# Altium schematic sheet Main.SchDoc
size A3; SheetNumber: 1; SheetTotal: 1
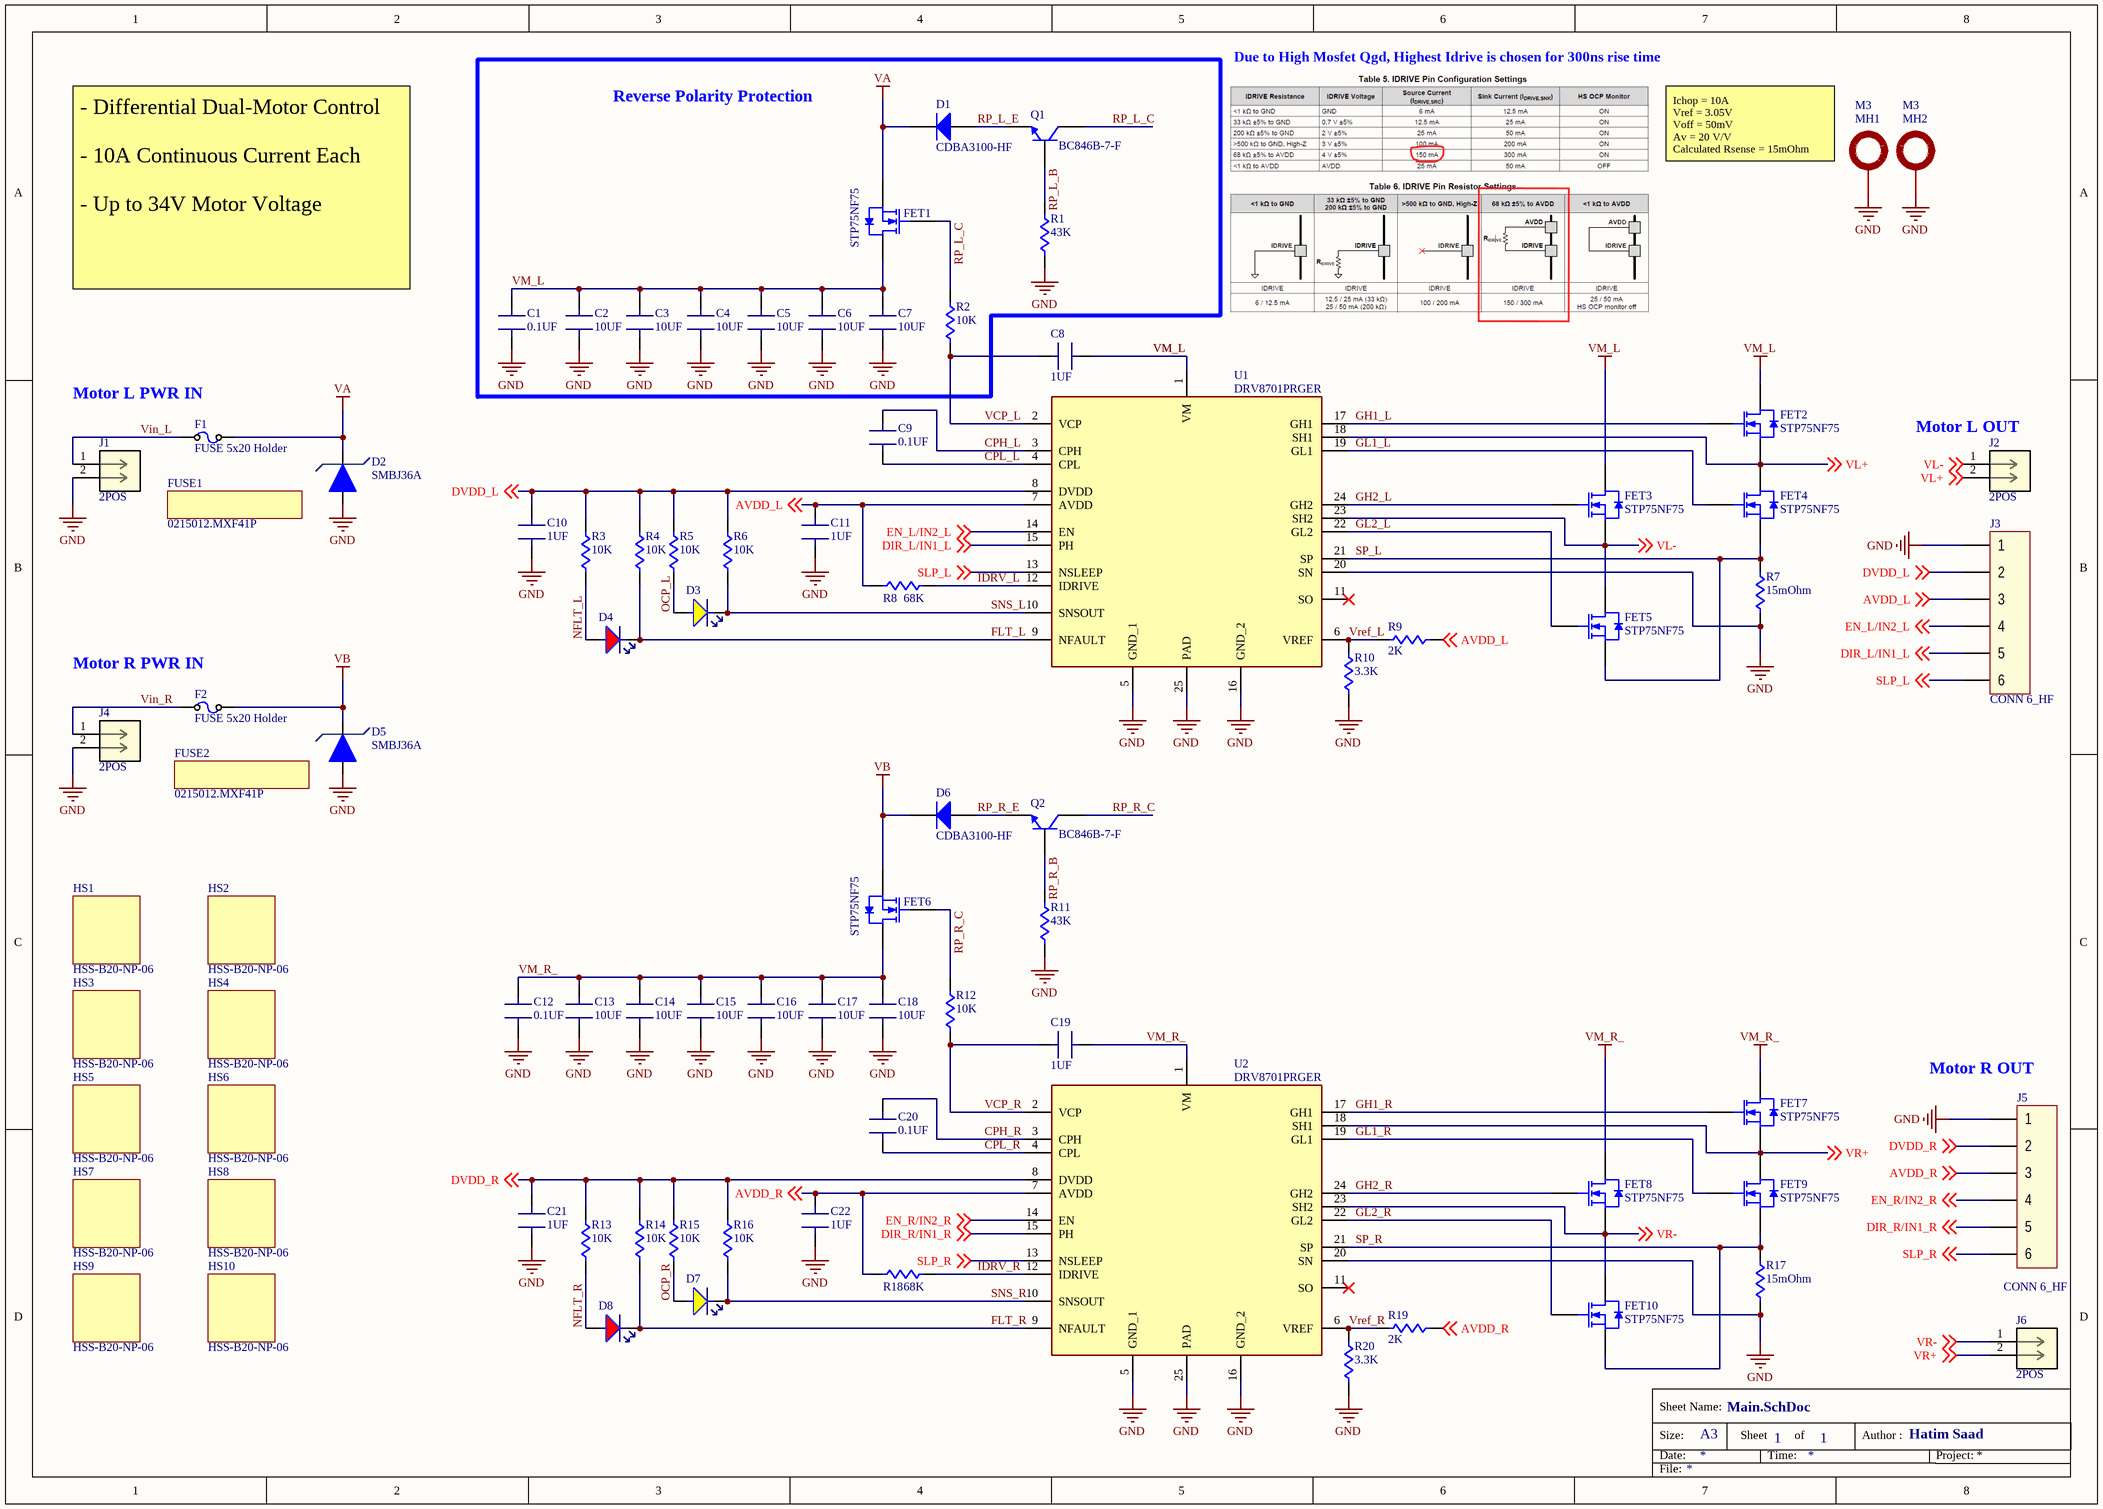
[diagram p0: Main.SchDoc]

## Parts
C1  0.1UF  [CAP: 0805]
C2  10UF  [CAP: 1210]
C3  10UF  [CAP: 1210]
C4  10UF  [CAP: 1210]
C5  10UF  [CAP: 1210]
C6  10UF  [CAP: 1210]
C7  10UF  [CAP: 1210]
C8  1UF  [CAP: 0805]
C9  0.1UF  [CAP: 0603]
C10  1UF  [CAP: 0603]
C11  1UF  [CAP: 0603]
C12  0.1UF  [CAP: 0805]
C13  10UF  [CAP: 1210]
C14  10UF  [CAP: 1210]
C15  10UF  [CAP: 1210]
C16  10UF  [CAP: 1210]
C17  10UF  [CAP: 1210]
C18  10UF  [CAP: 1210]
C19  1UF  [CAP: 0805]
C20  0.1UF  [CAP: 0603]
C21  1UF  [CAP: 0603]
C22  1UF  [CAP: 0603]
D1  CDBA3100-HF  [DIODE SMA]
D2  SMBJ36A  [DO-214AA]
D3  YELLOW  [LED: 0603Y]  (value not drawn)
D4  RED  [LED: 0603R]  (value not drawn)
D5  SMBJ36A  [DO-214AA]
D6  CDBA3100-HF  [DIODE SMA]
D7  YELLOW  [LED: 0603Y]  (value not drawn)
D8  RED  [LED: 0603R]  (value not drawn)
F1  FUSE 5x20 Holder  [FUSE: 5x20 Holder]
F2  FUSE 5x20 Holder  [FUSE: 5x20 Holder]
FET1  STP75NF75  [TO220-3]
FET2  STP75NF75  [TO220-3]
FET3  STP75NF75  [TO220-3]
FET4  STP75NF75  [TO220-3]
FET5  STP75NF75  [TO220-3]
FET6  STP75NF75  [TO220-3]
FET7  STP75NF75  [TO220-3]
FET8  STP75NF75  [TO220-3]
FET9  STP75NF75  [TO220-3]
FET10  STP75NF75  [TO220-3]
FUSE1  0215012.MXF41P  (mechanical)
FUSE2  0215012.MXF41P  (mechanical)
HS1  HSS-B20-NP-06  [HSS-B20-NP-06]
HS2  HSS-B20-NP-06  [HSS-B20-NP-06]
HS3  HSS-B20-NP-06  [HSS-B20-NP-06]
HS4  HSS-B20-NP-06  [HSS-B20-NP-06]
HS5  HSS-B20-NP-06  [HSS-B20-NP-06]
HS6  HSS-B20-NP-06  [HSS-B20-NP-06]
HS7  HSS-B20-NP-06  [HSS-B20-NP-06]
HS8  HSS-B20-NP-06  [HSS-B20-NP-06]
HS9  HSS-B20-NP-06  [HSS-B20-NP-06]
HS10  HSS-B20-NP-06  [HSS-B20-NP-06]
J1  2POS  [CONN2_710002_WRE - duplicate]
J2  2POS  [CONN2_710002_WRE - duplicate]
J3  CONN 6_HF  [CON: PLS-6]
J4  2POS  [CONN2_710002_WRE - duplicate]
J5  CONN 6_HF  [CON: PLS-6]
J6  2POS  [CONN2_710002_WRE - duplicate]
MH1  M3  [M3 Mounting Hole]  (no BOM)
MH2  M3  [M3 Mounting Hole]  (no BOM)
Q1  BC846B-7-F  [SOT23_3]
Q2  BC846B-7-F  [SOT23_3]
R1  43K  [RES: 0603]
R2  10K  [RES: 0805]
R3  10K  [RES: 0603]
R4  10K  [RES: 0603]
R5  10K  [RES: 0603]
R6  10K  [RES: 0603]
R7  15mOhm  [RES: 2512]
R8  68K  [RES: 0603]
R9  2K  [RES: 0603]
R10  3.3K  [RES: 0603]
R11  43K  [RES: 0603]
R12  10K  [RES: 0805]
R13  10K  [RES: 0603]
R14  10K  [RES: 0603]
R15  10K  [RES: 0603]
R16  10K  [RES: 0603]
R17  15mOhm  [RES: 2512]
R18  68K  [RES: 0603]
R19  2K  [RES: 0603]
R20  3.3K  [RES: 0603]
U1  DRV8701PRGER  [VQFN-24]
U2  DRV8701PRGER  [VQFN-24]

## Blocks framed on the sheet
Reverse Polarity Protection: C1-C7 D1 FET1 Q1 R1 R2

## Nets
GND: C1.1(A) C2.1(A) C3.1(A) C4.1(A) C5.1(A) C6.1(A) C7.1(A) C10.1(A) C11.1(A) C12.1(A) C13.1(A) C14.1(A) C15.1(A) C16.1(A) C17.1(A) C18.1(A) C21.1(A) C22.1(A) D2.1 D5.1 J1.2 J3.1 J4.2 J5.1 MH1.1 MH2.1 R1.1 R7.1 R10.2 R11.1 R17.1 R20.2 U1.5(GND_1) U1.16(GND_2) U1.20(SN) U1.25(PAD) U2.5(GND_1) U2.16(GND_2) U2.20(SN) U2.25(PAD)
VA: D1.2(K) D2.2 F1.2 FET1.3(S)
VB: D5.2 D6.2(K) F2.2 FET6.3(S)
VM_L: C1.2(B) C2.2(B) C3.2(B) C4.2(B) C5.2(B) C6.2(B) C7.2(B) C8.2(B) FET1.2(D) FET2.2(D) FET3.2(D) U1.1(VM)
VM_R_: C12.2(B) C13.2(B) C14.2(B) C15.2(B) C16.2(B) C17.2(B) C18.2(B) C19.2(B) FET6.2(D) FET7.2(D) FET8.2(D) U2.1(VM)
AVDD_L: C11.2(B) J3.3 R8.2 R9.2 U1.7(AVDD) ; off-sheet AVDD_L
AVDD_R: C22.2(B) J5.3 R18.2 R19.2 U2.7(AVDD) ; off-sheet AVDD_R
CPH_L: C9.2(B) U1.3(CPH)
CPH_R: C20.2(B) U2.3(CPH)
CPL_L: C9.1(A) U1.4(CPL)
CPL_R: C20.1(A) U2.4(CPL)
DIR_L/IN1_L: J3.5 U1.15(PH) ; off-sheet DIR_L/IN1_L
DIR_R/IN1_R: J5.5 U2.15(PH) ; off-sheet DIR_R/IN1_R
DVDD_L: C10.2(B) J3.2 R3.2 R4.2 R5.2 R6.2 U1.8(DVDD) ; off-sheet DVDD_L
DVDD_R: C21.2(B) J5.2 R13.2 R14.2 R15.2 R16.2 U2.8(DVDD) ; off-sheet DVDD_R
EN_L/IN2_L: J3.4 U1.14(EN) ; off-sheet EN_L/IN2_L
EN_R/IN2_R: J5.4 U2.14(EN) ; off-sheet EN_R/IN2_R
FLT_L: D4.1(C) R4.1 U1.9(NFAULT)
FLT_R: D8.1(C) R14.1 U2.9(NFAULT)
GH1_L: FET2.1(G) U1.17(GH1)
GH1_R: FET7.1(G) U2.17(GH1)
GH2_L: FET3.1(G) U1.24(GH2)
GH2_R: FET8.1(G) U2.24(GH2)
GL1_L: FET4.1(G) U1.19(GL1)
GL1_R: FET9.1(G) U2.19(GL1)
GL2_L: FET5.1(G) U1.22(GL2)
GL2_R: FET10.1(G) U2.22(GL2)
IDRV_L: R8.1 U1.12(IDRIVE)
IDRV_R: R18.1 U2.12(IDRIVE)
NFLT_L: D4.2(A) R3.1
NFLT_R: D8.2(A) R13.1
OCP_L: D3.2(A) R5.1
OCP_R: D7.2(A) R15.1
RP_L_B: Q1.1(B) R1.2
RP_L_C: FET1.1(G) Q1.3(C) R2.2
RP_L_E: D1.1(A) Q1.2(E)
RP_R_B: Q2.1(B) R11.2
RP_R_C: FET6.1(G) Q2.3(C) R12.2
RP_R_E: D6.1(A) Q2.2(E)
SLP_L: J3.6 U1.13(NSLEEP) ; off-sheet SLP_L
SLP_R: J5.6 U2.13(NSLEEP) ; off-sheet SLP_R
SNS_L: D3.1(C) R6.1 U1.10(SNSOUT)
SNS_R: D7.1(C) R16.1 U2.10(SNSOUT)
SP_L: FET4.3(S) FET5.3(S) R7.2 U1.21(SP)
SP_R: FET9.3(S) FET10.3(S) R17.2 U2.21(SP)
VCP_L: C8.1(A) R2.1 U1.2(VCP)
VCP_R: C19.1(A) R12.1 U2.2(VCP)
Vin_L: F1.1 J1.1
Vin_R: F2.1 J4.1
VL+: FET2.3(S) FET4.2(D) J2.2 U1.18(SH1) ; off-sheet VL+
VL-: FET3.3(S) FET5.2(D) J2.1 U1.23(SH2) ; off-sheet VL-
VR+: FET7.3(S) FET9.2(D) J6.2 U2.18(SH1) ; off-sheet VR+
VR-: FET8.3(S) FET10.2(D) J6.1 U2.23(SH2) ; off-sheet VR-
Vref_L: R9.1 R10.1 U1.6(VREF)
Vref_R: R19.1 R20.1 U2.6(VREF)

Not connected (* = marked no-connect by the designer): U1 11(SO)*; U2 11(SO)*

## Notes on the sheet
- Due to High Mosfet Qgd, Highest Idrive is chosen for 300ns rise time
- (near MH1) Ichop = 10A
  Vref = 3.05V
  Voff = 50mV
  Av = 20 V/V
  Calculated Rsense = 15mOhm
- - Differential Dual-Motor Control
  - 10A Continuous Current Each
  - Up to 34V Motor Voltage
- (near F1) Motor L PWR IN
- (near J2) Motor L OUT
- (near F2) Motor R PWR IN
- (near J5) Motor R OUT
- Size:
- Date:
- Sheet Name:
- A3
- Sheet
- Time:
- of
- Author :
- Hatim Saad
- Project:
- File:

## Library data of the parts
C1 C8 C12 C19 = CAP 0805: CAP SMD 0805
C2-C7 C13-C18 = CAP 1210: CAP SMD 1210
C9-C11 C20-C22 = CAP 0603: CAP SMD 0603
D1 D6 = 641-1747-1-ND: Diode Schottky 100V 3A (DC) Surface Mount DO-214AC (SMA); Supplier 1: Mouser; Supplier Part Number 1: 750-CDBA3100-HF
D2 D5 = SMBJ36A: ESD Protection Diodes / TVS Diodes 36volts 5uA 10.3 Amps Uni-Dir; Supplier 1: Mouser; Supplier Part Number 1: 652-SMBJ36A
D3 D7 = LED YELLOW 0603: LED YELLOW CLEAR 0603 SMD
D4 D8 = LED RED 0603: LED RED CLEAR 0603 SMD
F1 F2 = FUSE 5x20 Holder: FUSE: 5x20 Holder
FET1-FET10 = STP75NF75: MOSFETs N-Ch 75 Volt 80 Amp; Supplier 1: Mouser; Supplier Part Number 1: 511-STP75NF75
FUSE1 FUSE2 = 0215012.MXF41P: Cartridge Fuses FUSE 250V 5x20 PT RAD TL PB-FREE 12A; Supplier 1: Mouser; Supplier Part Number 1: 576-0215012.MXF41P
HS1-HS10 = HSS-B20-NP-06: Heat Sinks 19 x 19 x 9.52mm TO-220 bolt on; Supplier 1: Mouser; Supplier Part Number 1: 490-HSS-B20-NP-06
J1 J2 J4 J6 = 691213710002: TERM BLK 2POS SIDE ENTRY 5MM PCB; Mfr_Name: Wurth Electronics; RefDes: RefDes; Type: Type; Supplier 1: Mouser; Supplier Part Number 1: 710-691213710002
MH1 MH2 = Mounting Hole M3: Mounting Hole M3 Screw
Q1 Q2 = BC846B-FDICT-ND: Bipolar (BJT) Transistor NPN 65V 100mA 300MHz 300mW Surface Mount SOT-23-3; Supplier 1: Mouser; Supplier Part Number 1: 621-BC846B-7-F
R1 R3-R6 R8-R11 R13-R16 R18-R20 = RES 0603: RES SMD 0603
R2 R12 = RES 0805: RES SMD 0805
R7 R17 = CSNL2512FT15L0: Current Sense Resistors - SMD 0.015Ohms 2512 3W 50ppm 1% Metal Plate; Supplier 1: Mouser; Supplier Part Number 1: 708-CSNL2512FT15L0
U1 U2 = DRV8701PRGER: Motor/Motion/Ignition Controllers & Drivers 47-V H-bridge smart gate driver 24-VQFN; Supplier 1: Mouser; Supplier Part Number 1: 595-DRV8701PRGER